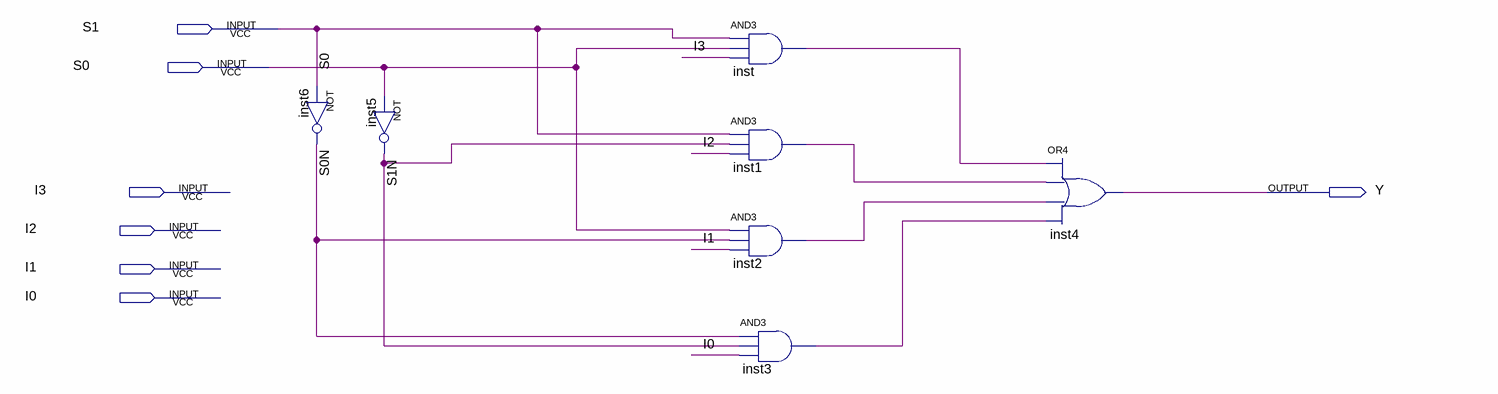
[diagram p0: schematic sheet]
// Quartus schematic MUX_41.bdf as structural Verilog: 7 symbols, 7 pins
module MUX_41 (
  input  S1,
  input  S0,
  input  I3,
  input  I2,
  input  I1,
  input  I0,
  output Y
);

  wire inst1_out, inst2_out, inst3_out, inst_out, S0N, S1N;

  not inst6 (S0N, S0);
  not inst5 (S1N, S0);
  and inst (inst_out, S0, S0, I3);
  and inst1 (inst1_out, S0, S1N, I2);
  and inst2 (inst2_out, S0, S0N, I1);
  and inst3 (inst3_out, S0N, S1N, I0);
  or inst4 (Y, inst_out, inst1_out, inst2_out, inst3_out);

  assign S1 = S0;
endmodule
